# Altium schematic sheet Input10-18.SchDoc
size 594 x 420 mm; SheetNumber: 5; SheetTotal: 9; Обозначение документа: QFP input10-18; Номер листа: 5; Общее количество листов: 9
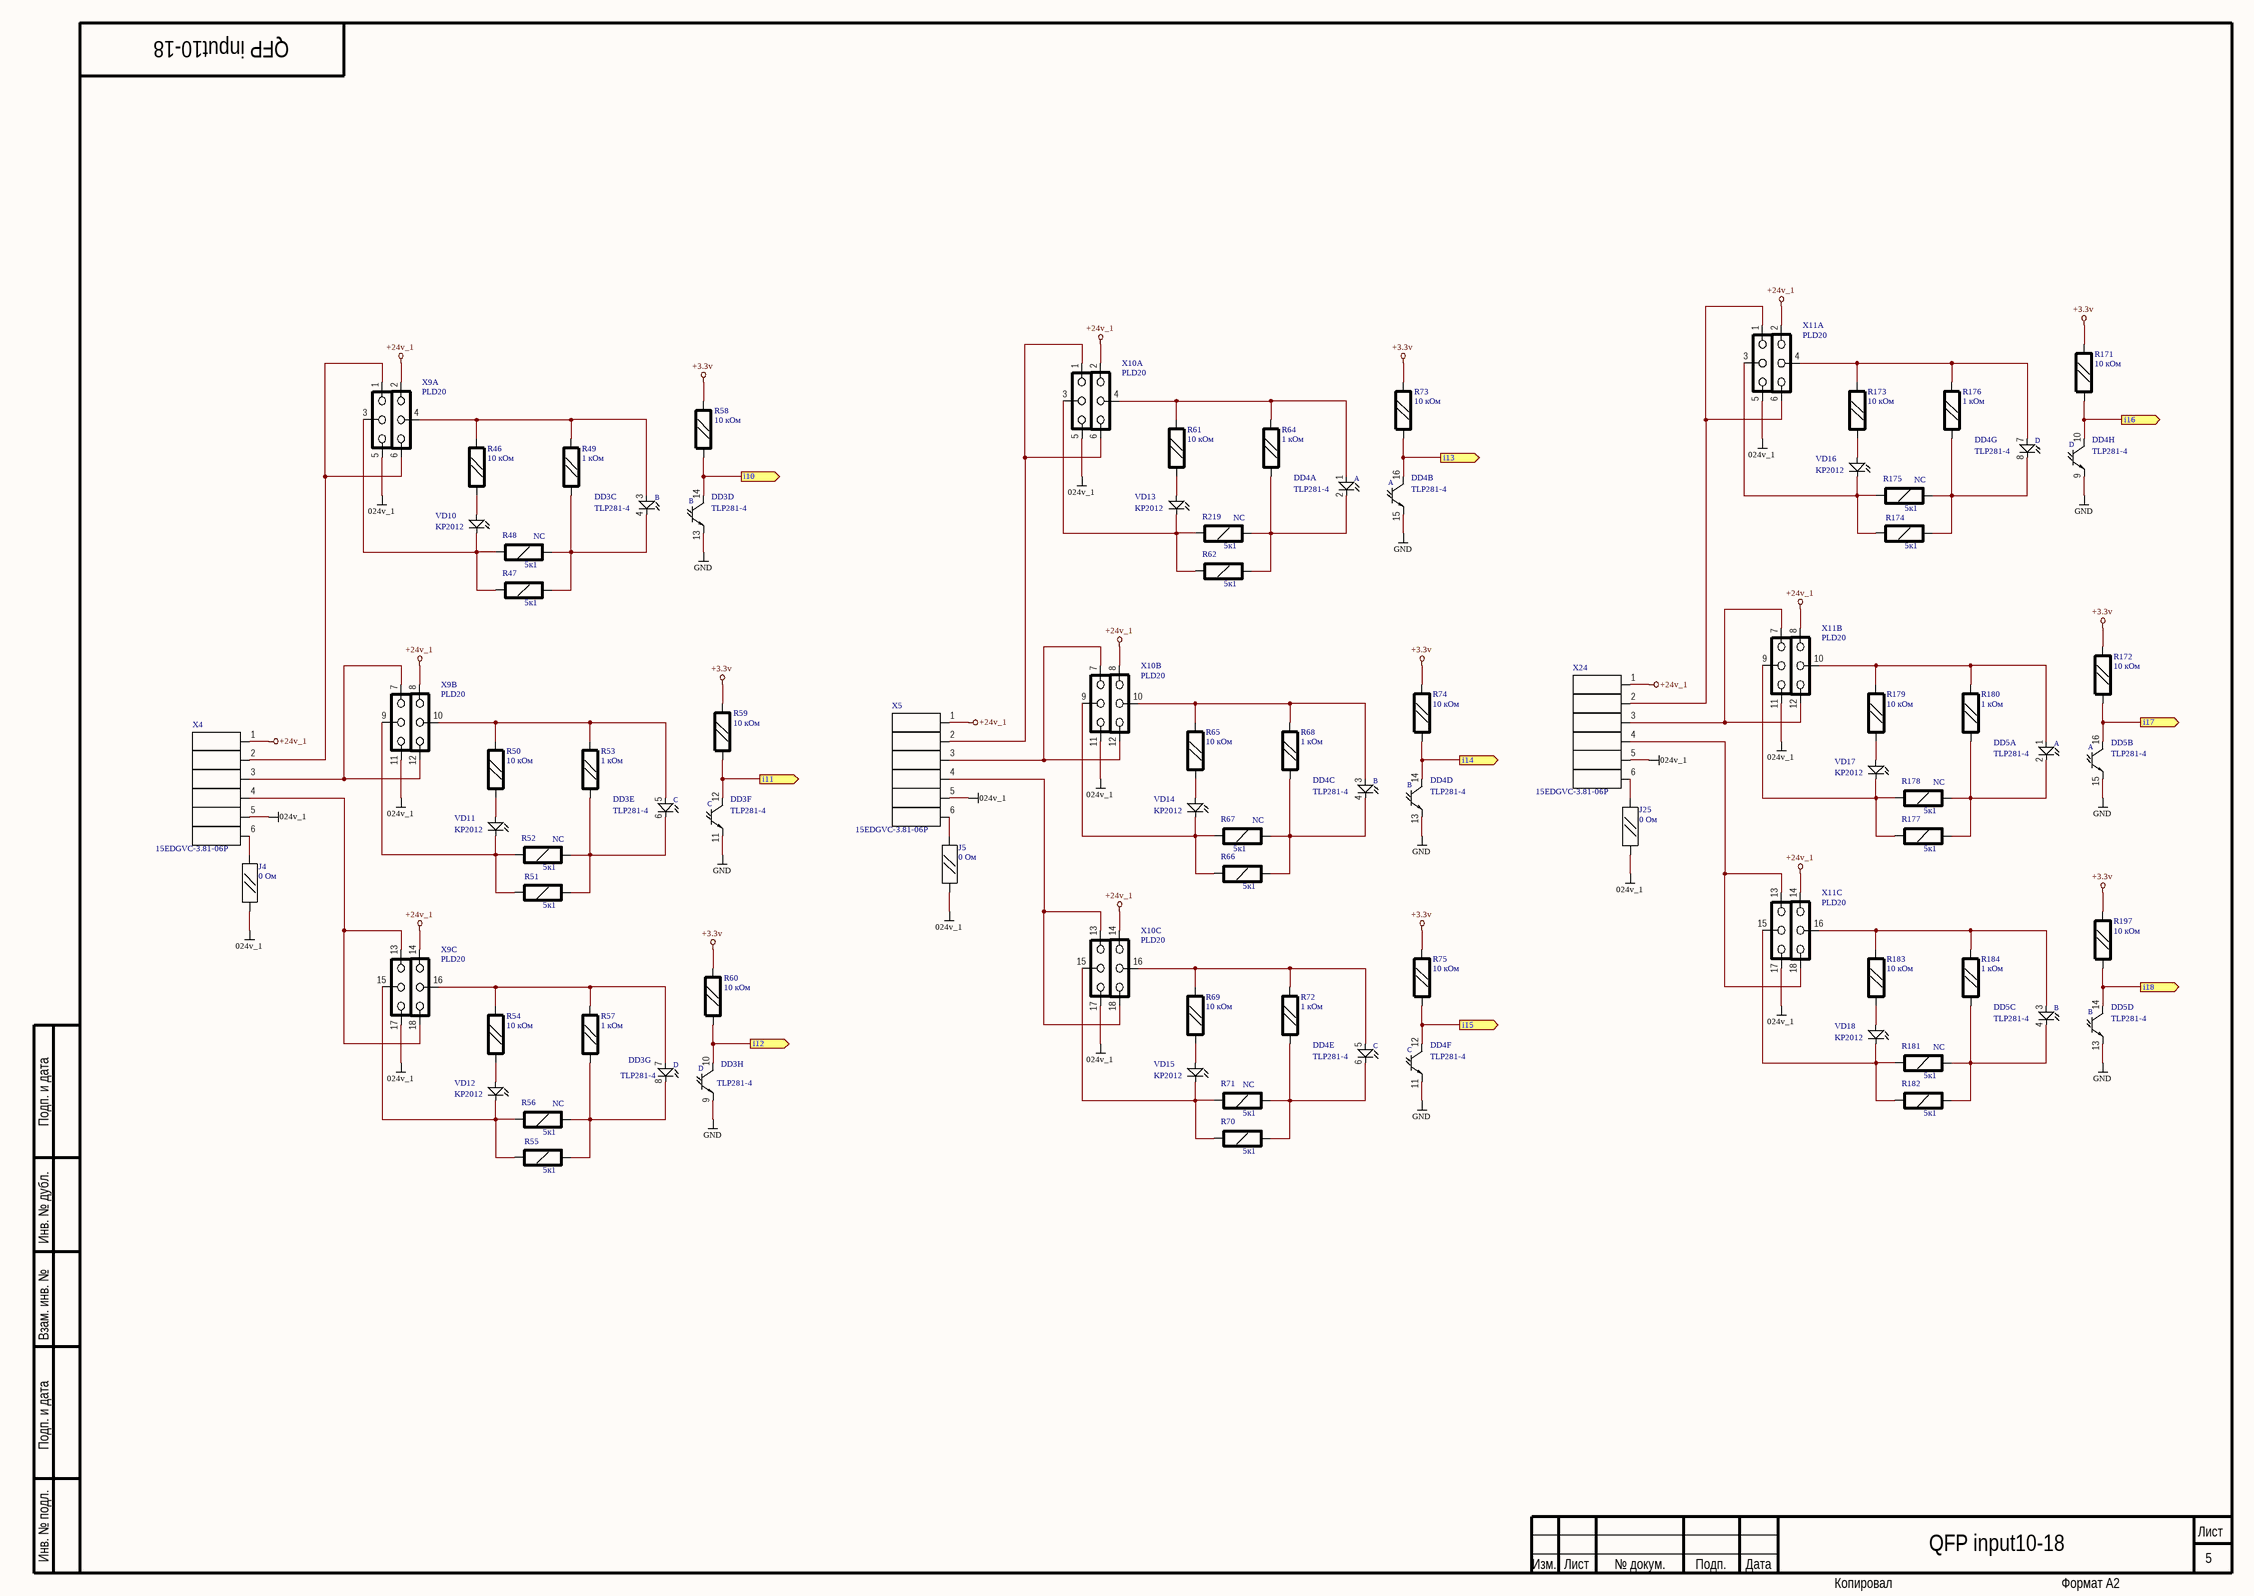
[diagram p0: Input10-18.SchDoc]

## Parts
DD3  TLP281-4  [SO16]  (parts C,D,E,F,G,H of 8)
DD4  TLP281-4  [SO16]  (parts A,B,C,D,E,F,G,H of 8)
DD5  TLP281-4  [SO16]  (parts A,B,C,D of 8)
J4  0 Ом  [SMD0805RES]
J5  0 Ом  [SMD0805RES]
J25  0 Ом  [SMD0805RES]
R46  10 кОм  [SMD0805RES]
R47  5к1  [RES1206]
R48  5к1  SolderOpton: NC  [RES1206]
R49  1 кОм  [SMD0805RES]
R50  10 кОм  [SMD0805RES]
R51  5к1  [RES1206]
R52  5к1  SolderOpton: NC  [RES1206]
R53  1 кОм  [SMD0805RES]
R54  10 кОм  [SMD0805RES]
R55  5к1  [RES1206]
R56  5к1  SolderOpton: NC  [RES1206]
R57  1 кОм  [SMD0805RES]
R58  10 кОм  [SMD0805RES]
R59  10 кОм  [SMD0805RES]
R60  10 кОм  [SMD0805RES]
R61  10 кОм  [SMD0805RES]
R62  5к1  [RES1206]
R64  1 кОм  [SMD0805RES]
R65  10 кОм  [SMD0805RES]
R66  5к1  [RES1206]
R67  5к1  SolderOpton: NC  [RES1206]
R68  1 кОм  [SMD0805RES]
R69  10 кОм  [SMD0805RES]
R70  5к1  [RES1206]
R71  5к1  SolderOpton: NC  [RES1206]
R72  1 кОм  [SMD0805RES]
R73  10 кОм  [SMD0805RES]
R74  10 кОм  [SMD0805RES]
R75  10 кОм  [SMD0805RES]
R171  10 кОм  [SMD0805RES]
R172  10 кОм  [SMD0805RES]
R173  10 кОм  [SMD0805RES]
R174  5к1  [RES1206]
R175  5к1  SolderOpton: NC  [RES1206]
R176  1 кОм  [SMD0805RES]
R177  5к1  [RES1206]
R178  5к1  SolderOpton: NC  [RES1206]
R179  10 кОм  [SMD0805RES]
R180  1 кОм  [SMD0805RES]
R181  5к1  SolderOpton: NC  [RES1206]
R182  5к1  [RES1206]
R183  10 кОм  [SMD0805RES]
R184  1 кОм  [SMD0805RES]
R197  10 кОм  [SMD0805RES]
R219  5к1  SolderOpton: NC  [RES1206]
VD10  KP2012  [SMD0805DIO_C]
VD11  KP2012  [SMD0805DIO_C]
VD12  KP2012  [SMD0805DIO_C]
VD13  KP2012  [SMD0805DIO_C]
VD14  KP2012  [SMD0805DIO_C]
VD15  KP2012  [SMD0805DIO_C]
VD16  KP2012  [SMD0805DIO_C]
VD17  KP2012  [SMD0805DIO_C]
VD18  KP2012  [SMD0805DIO_C]
X4  15EDGVC-3.81-06P  [15EDGVC_081_6]
X5  15EDGVC-3.81-06P  [15EDGVC_081_6]
X9  PLD20  [pld2x10_1.27]  (parts A,B,C of 7)
X10  PLD20  [pld2x10_1.27]  (parts A,B,C of 7)
X11  PLD20  [pld2x10_1.27]  (parts A,B,C of 7)
X24  15EDGVC-3.81-06P  [15EDGVC_081_6]

## Ports
i10 (out), i11 (out), i12 (out), i13 (out), i14 (out), i15 (out), i16 (out), i17 (out), i18 (out)

## Nets
024v_1: J4.2 J5.2 J25.2 X4.5 X5.5 X9.5 X9.11 X9.17 X10.5 X10.11 X10.17 X11.5 X11.11 X11.17 X24.5
+3.3v: R58.2 R59.2 R60.2 R73.2 R74.2 R75.2 R171.2 R172.2 R197.2
+24v_1: X4.1 X5.1 X9.2 X9.8 X9.14 X10.2 X10.8 X10.14 X11.2 X11.8 X11.14 X24.1
GND: DD3.9(Emitter_D) DD3.11(Emitter_C) DD3.13(Emitter_B) DD4.9(Emitter_D) DD4.11(Emitter_C) DD4.13(Emitter_B) DD4.15(Emitter_A) DD5.13(Emitter_B) DD5.15(Emitter_A)
i10: DD3.14(Collector_B) R58.1 ; port i10
i11: DD3.12(Collector_C) R59.1 ; port i11
i12: DD3.10(Collector_D) R60.1 ; port i12
i13: DD4.16(Collector_A) R73.1 ; port i13
i14: DD4.14(Collector_B) R74.1 ; port i14
i15: DD4.12(Collector_C) R75.1 ; port i15
i16: DD4.10(Collector_D) R171.1 ; port i16
i17: DD5.16(Collector_A) R172.1 ; port i17
i18: DD5.14(Collector_B) R197.1 ; port i18
NetDD3_3: DD3.3(Anode_B) R46.1 R49.1 X9.4
NetDD3_4: DD3.4(Cathode_B) R47.2 R48.2 R49.2
NetDD3_5: DD3.5(Anode_C) R50.1 R53.1 X9.10
NetDD3_6: DD3.6(Cathode) R51.2 R52.2 R53.2
NetDD3_7: DD3.7(Anode_D) R54.1 R57.1 X9.16
NetDD3_8: DD3.8(Cathode_D) R55.2 R56.2 R57.2
NetDD4_1: DD4.1(Anode_A) R61.1 R64.1 X10.4
NetDD4_2: DD4.2(Cathode_A) R62.2 R64.2 R219.2
NetDD4_3: DD4.3(Anode_B) R65.1 R68.1 X10.10
NetDD4_4: DD4.4(Cathode_B) R66.2 R67.2 R68.2
NetDD4_5: DD4.5(Anode_C) R69.1 R72.1 X10.16
NetDD4_6: DD4.6(Cathode) R70.2 R71.2 R72.2
NetDD4_7: DD4.7(Anode_D) R173.1 R176.1 X11.4
NetDD4_8: DD4.8(Cathode_D) R174.2 R175.2 R176.2
NetDD5_1: DD5.1(Anode_A) R179.1 R180.1 X11.10
NetDD5_2: DD5.2(Cathode_A) R177.2 R178.2 R180.2
NetDD5_3: DD5.3(Anode_B) R183.1 R184.1 X11.16
NetDD5_4: DD5.4(Cathode_B) R181.2 R182.2 R184.2
NetJ4_1: J4.1 X4.6
NetJ5_1: J5.1 X5.6
NetJ25_1: J25.1 X24.6
NetR46_2: R46.2 VD10.2(Anode)
NetR47_1: R47.1 R48.1 VD10.1(Cathode) X9.3
NetR50_2: R50.2 VD11.2(Anode)
NetR51_1: R51.1 R52.1 VD11.1(Cathode) X9.9
NetR54_2: R54.2 VD12.2(Anode)
NetR55_1: R55.1 R56.1 VD12.1(Cathode) X9.15
NetR61_2: R61.2 VD13.2(Anode)
NetR62_1: R62.1 R219.1 VD13.1(Cathode) X10.3
NetR65_2: R65.2 VD14.2(Anode)
NetR66_1: R66.1 R67.1 VD14.1(Cathode) X10.9
NetR69_2: R69.2 VD15.2(Anode)
NetR70_1: R70.1 R71.1 VD15.1(Cathode) X10.15
NetR173_2: R173.2 VD16.2(Anode)
NetR174_1: R174.1 R175.1 VD16.1(Cathode) X11.3
NetR177_1: R177.1 R178.1 VD17.1(Cathode) X11.9
NetR179_2: R179.2 VD17.2(Anode)
NetR181_1: R181.1 R182.1 VD18.1(Cathode) X11.15
NetR183_2: R183.2 VD18.2(Anode)
NetX4_2: X4.2 X9.1 X9.6
NetX4_3: X4.3 X9.7 X9.12
NetX4_4: X4.4 X9.13 X9.18
NetX5_2: X5.2 X10.1 X10.6
NetX5_3: X5.3 X10.7 X10.12
NetX5_4: X5.4 X10.13 X10.18
NetX11_1: X11.1 X11.6 X24.2
NetX11_7: X11.7 X11.12 X24.3
NetX11_13: X11.13 X11.18 X24.4

## Notes on the sheet
- Подп. и дата
- Инв. № дубл.
- Взам. инв. №
- Инв. № подл.
- Изм.
- Лист
- № докум.
- Подп.
- Дата
- Копировал
- Формат А2
- (in symbol TLP281-4, part A) A
- (in symbol TLP281-4, part B) A
- (in symbol TLP281-4, part C) B
- (in symbol TLP281-4, part D) B
- (in symbol TLP281-4, part E) C
- (in symbol TLP281-4, part F) C
- (in symbol TLP281-4, part G) D
- (in symbol TLP281-4, part H) D

## Library data of the parts
DD3-DD5 = TLP281-4: 4х канальная транзисторная оптопара; Vendor: Tosba; Voltage: 80V; SolderOptoin: Norm; Value: TLP281-4; Price: 250
J4 J5 J25 = JR0805: SMD 0805 перемычка; SolderOption: Norm; Price: 2; Vendor: *; Value: 0 Ом
R46 R49 R50 R53 R54 R57-R61 R64 R65 R68 R69 R72-R75 R171-R173 R176 R179 R180 R183 R184 R197 = R0805: Чип резистор 0805; Vendor: Generic; Tolerance: 5%; SolderOpton: Norm; Price: 2
  R46 R50 R54 R58-R61 R65 R69 R73-R75 R171-R173 R179 R183 R197: Value: 10 кОм
  R49 R53 R57 R64 R68 R72 R176 R180 R184: Value: 1 кОм
R47 R51 R55 R62 R66 R70 R174 R177 R182 = R1206: Чип резистор 1206; Vendor: Generic; Tolerance: 5%; SolderOpton: Norm; Price: 2; Value: 5к1
R48 R52 R56 R67 R71 R175 R178 R181 R219 = R1206: Чип резистор 1206; Vendor: Generic; Tolerance: 5%; Price: 2; Value: 5к1
VD10-VD18 = KP2012_C: Чип светодиод 0805; Vendor: KB; Color: Green; SolderOpton: Norm; Price: 20; Value: KP2012
X4 X5 X24 = 15EDGVC-3.81-06P: Вилка  6/3.81; Vendor: Degson; Current: 8А; Voltage: 2кВ; Price: 50; Value: 15EDGVC-3.81-06P
X9-X11 = PLD20: Вилка  PLD 20/1.27; Vendor: Confly; SolderOption: Norm; Price: 10; Value: PLD20